# Altium schematic sheet rf_antenna.SchDoc: Magic Baton: RF
size Letter
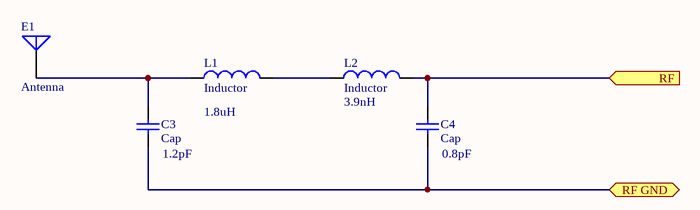
[diagram p0: rf_antenna.SchDoc]

## Parts
C3  Cap  value 1.2pF  [RAD-0.3]
C4  Cap  value 0.8pF  [RAD-0.3]
E1  Antenna  [PIN1]
L1  Inductor  value 1.8uH  [0402-A]
L2  Inductor  value 3.9nH  [0402-A]

## Ports
RF (in), RF GND (bidir)

## Nets
RF: C4.1 L2.2 ; port RF
RF GND: C3.2 C4.2 ; port RF GND
NetC3_1: C3.1 E1.1(A) L1.1
NetL1_2: L1.2 L2.1

## Notes on the sheet
- Title
- Size:
- Date:
- Letter
- Number:
- Time:
- Revision:
- Sheet
- of
- File:

## Library data of the parts
C3 C4 = Cap: Capacitor; Published: 8-Jun-2000; LatestRevisionDate: 17-Jul-2002; LatestRevisionNote: Re-released for DXP Platform.; PackageReference: RAD-0.3; Publisher: Altium Limited; PackageDescription: Radial Cap, Thru-Hole; 2 Leads; 0.3 in Pin Spacing
E1 = Antenna: Generic Antenna; Published: 24-Mar-1999; LatestRevisionDate: 17-Jul-2002; LatestRevisionNote: Re-released for DXP Platform.; PackageReference: PIN1; Publisher: Altium Limited
L1 L2 = Inductor: Code_IEC: 1005; Published: 8-Jun-2000; LatestRevisionDate: 29-May-2009; LatestRevisionNote: IPC-7351 Footprint Added.; PackageReference: 0402-A; Publisher: Altium Limited; PackageDescription: Chip Inductor; Code_JEITA: 0402